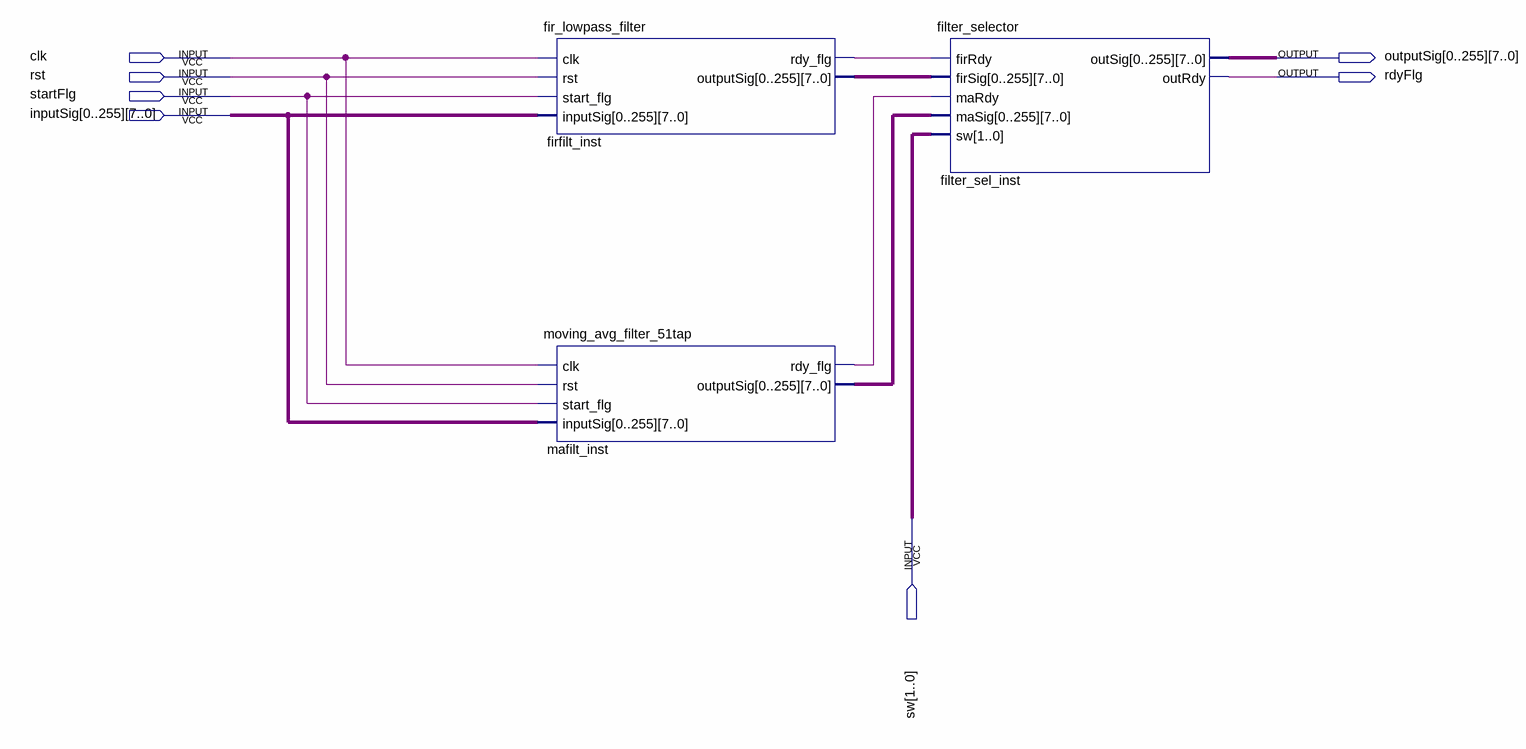
[diagram p0: schematic sheet]
// Quartus schematic Filters.bdf as structural Verilog: 3 symbols, 7 pins
module Filters (
  input  clk,
  input  rst,
  input  startFlg,
  input  [7:0] inputSig_0,
  input  [7:0] inputSig_1,
  input  [7:0] inputSig_2,
  input  [7:0] inputSig_3,
  input  [7:0] inputSig_4,
  input  [7:0] inputSig_5,
  input  [7:0] inputSig_6,
  input  [7:0] inputSig_7,
  input  [7:0] inputSig_8,
  input  [7:0] inputSig_9,
  input  [7:0] inputSig_10,
  input  [7:0] inputSig_11,
  input  [7:0] inputSig_12,
  input  [7:0] inputSig_13,
  input  [7:0] inputSig_14,
  input  [7:0] inputSig_15,
  input  [7:0] inputSig_16,
  input  [7:0] inputSig_17,
  input  [7:0] inputSig_18,
  input  [7:0] inputSig_19,
  input  [7:0] inputSig_20,
  input  [7:0] inputSig_21,
  input  [7:0] inputSig_22,
  input  [7:0] inputSig_23,
  input  [7:0] inputSig_24,
  input  [7:0] inputSig_25,
  input  [7:0] inputSig_26,
  input  [7:0] inputSig_27,
  input  [7:0] inputSig_28,
  input  [7:0] inputSig_29,
  input  [7:0] inputSig_30,
  input  [7:0] inputSig_31,
  input  [7:0] inputSig_32,
  input  [7:0] inputSig_33,
  input  [7:0] inputSig_34,
  input  [7:0] inputSig_35,
  input  [7:0] inputSig_36,
  input  [7:0] inputSig_37,
  input  [7:0] inputSig_38,
  input  [7:0] inputSig_39,
  input  [7:0] inputSig_40,
  input  [7:0] inputSig_41,
  input  [7:0] inputSig_42,
  input  [7:0] inputSig_43,
  input  [7:0] inputSig_44,
  input  [7:0] inputSig_45,
  input  [7:0] inputSig_46,
  input  [7:0] inputSig_47,
  input  [7:0] inputSig_48,
  input  [7:0] inputSig_49,
  input  [7:0] inputSig_50,
  input  [7:0] inputSig_51,
  input  [7:0] inputSig_52,
  input  [7:0] inputSig_53,
  input  [7:0] inputSig_54,
  input  [7:0] inputSig_55,
  input  [7:0] inputSig_56,
  input  [7:0] inputSig_57,
  input  [7:0] inputSig_58,
  input  [7:0] inputSig_59,
  input  [7:0] inputSig_60,
  input  [7:0] inputSig_61,
  input  [7:0] inputSig_62,
  input  [7:0] inputSig_63,
  input  [7:0] inputSig_64,
  input  [7:0] inputSig_65,
  input  [7:0] inputSig_66,
  input  [7:0] inputSig_67,
  input  [7:0] inputSig_68,
  input  [7:0] inputSig_69,
  input  [7:0] inputSig_70,
  input  [7:0] inputSig_71,
  input  [7:0] inputSig_72,
  input  [7:0] inputSig_73,
  input  [7:0] inputSig_74,
  input  [7:0] inputSig_75,
  input  [7:0] inputSig_76,
  input  [7:0] inputSig_77,
  input  [7:0] inputSig_78,
  input  [7:0] inputSig_79,
  input  [7:0] inputSig_80,
  input  [7:0] inputSig_81,
  input  [7:0] inputSig_82,
  input  [7:0] inputSig_83,
  input  [7:0] inputSig_84,
  input  [7:0] inputSig_85,
  input  [7:0] inputSig_86,
  input  [7:0] inputSig_87,
  input  [7:0] inputSig_88,
  input  [7:0] inputSig_89,
  input  [7:0] inputSig_90,
  input  [7:0] inputSig_91,
  input  [7:0] inputSig_92,
  input  [7:0] inputSig_93,
  input  [7:0] inputSig_94,
  input  [7:0] inputSig_95,
  input  [7:0] inputSig_96,
  input  [7:0] inputSig_97,
  input  [7:0] inputSig_98,
  input  [7:0] inputSig_99,
  input  [7:0] inputSig_100,
  input  [7:0] inputSig_101,
  input  [7:0] inputSig_102,
  input  [7:0] inputSig_103,
  input  [7:0] inputSig_104,
  input  [7:0] inputSig_105,
  input  [7:0] inputSig_106,
  input  [7:0] inputSig_107,
  input  [7:0] inputSig_108,
  input  [7:0] inputSig_109,
  input  [7:0] inputSig_110,
  input  [7:0] inputSig_111,
  input  [7:0] inputSig_112,
  input  [7:0] inputSig_113,
  input  [7:0] inputSig_114,
  input  [7:0] inputSig_115,
  input  [7:0] inputSig_116,
  input  [7:0] inputSig_117,
  input  [7:0] inputSig_118,
  input  [7:0] inputSig_119,
  input  [7:0] inputSig_120,
  input  [7:0] inputSig_121,
  input  [7:0] inputSig_122,
  input  [7:0] inputSig_123,
  input  [7:0] inputSig_124,
  input  [7:0] inputSig_125,
  input  [7:0] inputSig_126,
  input  [7:0] inputSig_127,
  input  [7:0] inputSig_128,
  input  [7:0] inputSig_129,
  input  [7:0] inputSig_130,
  input  [7:0] inputSig_131,
  input  [7:0] inputSig_132,
  input  [7:0] inputSig_133,
  input  [7:0] inputSig_134,
  input  [7:0] inputSig_135,
  input  [7:0] inputSig_136,
  input  [7:0] inputSig_137,
  input  [7:0] inputSig_138,
  input  [7:0] inputSig_139,
  input  [7:0] inputSig_140,
  input  [7:0] inputSig_141,
  input  [7:0] inputSig_142,
  input  [7:0] inputSig_143,
  input  [7:0] inputSig_144,
  input  [7:0] inputSig_145,
  input  [7:0] inputSig_146,
  input  [7:0] inputSig_147,
  input  [7:0] inputSig_148,
  input  [7:0] inputSig_149,
  input  [7:0] inputSig_150,
  input  [7:0] inputSig_151,
  input  [7:0] inputSig_152,
  input  [7:0] inputSig_153,
  input  [7:0] inputSig_154,
  input  [7:0] inputSig_155,
  input  [7:0] inputSig_156,
  input  [7:0] inputSig_157,
  input  [7:0] inputSig_158,
  input  [7:0] inputSig_159,
  input  [7:0] inputSig_160,
  input  [7:0] inputSig_161,
  input  [7:0] inputSig_162,
  input  [7:0] inputSig_163,
  input  [7:0] inputSig_164,
  input  [7:0] inputSig_165,
  input  [7:0] inputSig_166,
  input  [7:0] inputSig_167,
  input  [7:0] inputSig_168,
  input  [7:0] inputSig_169,
  input  [7:0] inputSig_170,
  input  [7:0] inputSig_171,
  input  [7:0] inputSig_172,
  input  [7:0] inputSig_173,
  input  [7:0] inputSig_174,
  input  [7:0] inputSig_175,
  input  [7:0] inputSig_176,
  input  [7:0] inputSig_177,
  input  [7:0] inputSig_178,
  input  [7:0] inputSig_179,
  input  [7:0] inputSig_180,
  input  [7:0] inputSig_181,
  input  [7:0] inputSig_182,
  input  [7:0] inputSig_183,
  input  [7:0] inputSig_184,
  input  [7:0] inputSig_185,
  input  [7:0] inputSig_186,
  input  [7:0] inputSig_187,
  input  [7:0] inputSig_188,
  input  [7:0] inputSig_189,
  input  [7:0] inputSig_190,
  input  [7:0] inputSig_191,
  input  [7:0] inputSig_192,
  input  [7:0] inputSig_193,
  input  [7:0] inputSig_194,
  input  [7:0] inputSig_195,
  input  [7:0] inputSig_196,
  input  [7:0] inputSig_197,
  input  [7:0] inputSig_198,
  input  [7:0] inputSig_199,
  input  [7:0] inputSig_200,
  input  [7:0] inputSig_201,
  input  [7:0] inputSig_202,
  input  [7:0] inputSig_203,
  input  [7:0] inputSig_204,
  input  [7:0] inputSig_205,
  input  [7:0] inputSig_206,
  input  [7:0] inputSig_207,
  input  [7:0] inputSig_208,
  input  [7:0] inputSig_209,
  input  [7:0] inputSig_210,
  input  [7:0] inputSig_211,
  input  [7:0] inputSig_212,
  input  [7:0] inputSig_213,
  input  [7:0] inputSig_214,
  input  [7:0] inputSig_215,
  input  [7:0] inputSig_216,
  input  [7:0] inputSig_217,
  input  [7:0] inputSig_218,
  input  [7:0] inputSig_219,
  input  [7:0] inputSig_220,
  input  [7:0] inputSig_221,
  input  [7:0] inputSig_222,
  input  [7:0] inputSig_223,
  input  [7:0] inputSig_224,
  input  [7:0] inputSig_225,
  input  [7:0] inputSig_226,
  input  [7:0] inputSig_227,
  input  [7:0] inputSig_228,
  input  [7:0] inputSig_229,
  input  [7:0] inputSig_230,
  input  [7:0] inputSig_231,
  input  [7:0] inputSig_232,
  input  [7:0] inputSig_233,
  input  [7:0] inputSig_234,
  input  [7:0] inputSig_235,
  input  [7:0] inputSig_236,
  input  [7:0] inputSig_237,
  input  [7:0] inputSig_238,
  input  [7:0] inputSig_239,
  input  [7:0] inputSig_240,
  input  [7:0] inputSig_241,
  input  [7:0] inputSig_242,
  input  [7:0] inputSig_243,
  input  [7:0] inputSig_244,
  input  [7:0] inputSig_245,
  input  [7:0] inputSig_246,
  input  [7:0] inputSig_247,
  input  [7:0] inputSig_248,
  input  [7:0] inputSig_249,
  input  [7:0] inputSig_250,
  input  [7:0] inputSig_251,
  input  [7:0] inputSig_252,
  input  [7:0] inputSig_253,
  input  [7:0] inputSig_254,
  input  [7:0] inputSig_255,
  input  [1:0] sw,
  output [7:0] outputSig_0,
  output [7:0] outputSig_1,
  output [7:0] outputSig_2,
  output [7:0] outputSig_3,
  output [7:0] outputSig_4,
  output [7:0] outputSig_5,
  output [7:0] outputSig_6,
  output [7:0] outputSig_7,
  output [7:0] outputSig_8,
  output [7:0] outputSig_9,
  output [7:0] outputSig_10,
  output [7:0] outputSig_11,
  output [7:0] outputSig_12,
  output [7:0] outputSig_13,
  output [7:0] outputSig_14,
  output [7:0] outputSig_15,
  output [7:0] outputSig_16,
  output [7:0] outputSig_17,
  output [7:0] outputSig_18,
  output [7:0] outputSig_19,
  output [7:0] outputSig_20,
  output [7:0] outputSig_21,
  output [7:0] outputSig_22,
  output [7:0] outputSig_23,
  output [7:0] outputSig_24,
  output [7:0] outputSig_25,
  output [7:0] outputSig_26,
  output [7:0] outputSig_27,
  output [7:0] outputSig_28,
  output [7:0] outputSig_29,
  output [7:0] outputSig_30,
  output [7:0] outputSig_31,
  output [7:0] outputSig_32,
  output [7:0] outputSig_33,
  output [7:0] outputSig_34,
  output [7:0] outputSig_35,
  output [7:0] outputSig_36,
  output [7:0] outputSig_37,
  output [7:0] outputSig_38,
  output [7:0] outputSig_39,
  output [7:0] outputSig_40,
  output [7:0] outputSig_41,
  output [7:0] outputSig_42,
  output [7:0] outputSig_43,
  output [7:0] outputSig_44,
  output [7:0] outputSig_45,
  output [7:0] outputSig_46,
  output [7:0] outputSig_47,
  output [7:0] outputSig_48,
  output [7:0] outputSig_49,
  output [7:0] outputSig_50,
  output [7:0] outputSig_51,
  output [7:0] outputSig_52,
  output [7:0] outputSig_53,
  output [7:0] outputSig_54,
  output [7:0] outputSig_55,
  output [7:0] outputSig_56,
  output [7:0] outputSig_57,
  output [7:0] outputSig_58,
  output [7:0] outputSig_59,
  output [7:0] outputSig_60,
  output [7:0] outputSig_61,
  output [7:0] outputSig_62,
  output [7:0] outputSig_63,
  output [7:0] outputSig_64,
  output [7:0] outputSig_65,
  output [7:0] outputSig_66,
  output [7:0] outputSig_67,
  output [7:0] outputSig_68,
  output [7:0] outputSig_69,
  output [7:0] outputSig_70,
  output [7:0] outputSig_71,
  output [7:0] outputSig_72,
  output [7:0] outputSig_73,
  output [7:0] outputSig_74,
  output [7:0] outputSig_75,
  output [7:0] outputSig_76,
  output [7:0] outputSig_77,
  output [7:0] outputSig_78,
  output [7:0] outputSig_79,
  output [7:0] outputSig_80,
  output [7:0] outputSig_81,
  output [7:0] outputSig_82,
  output [7:0] outputSig_83,
  output [7:0] outputSig_84,
  output [7:0] outputSig_85,
  output [7:0] outputSig_86,
  output [7:0] outputSig_87,
  output [7:0] outputSig_88,
  output [7:0] outputSig_89,
  output [7:0] outputSig_90,
  output [7:0] outputSig_91,
  output [7:0] outputSig_92,
  output [7:0] outputSig_93,
  output [7:0] outputSig_94,
  output [7:0] outputSig_95,
  output [7:0] outputSig_96,
  output [7:0] outputSig_97,
  output [7:0] outputSig_98,
  output [7:0] outputSig_99,
  output [7:0] outputSig_100,
  output [7:0] outputSig_101,
  output [7:0] outputSig_102,
  output [7:0] outputSig_103,
  output [7:0] outputSig_104,
  output [7:0] outputSig_105,
  output [7:0] outputSig_106,
  output [7:0] outputSig_107,
  output [7:0] outputSig_108,
  output [7:0] outputSig_109,
  output [7:0] outputSig_110,
  output [7:0] outputSig_111,
  output [7:0] outputSig_112,
  output [7:0] outputSig_113,
  output [7:0] outputSig_114,
  output [7:0] outputSig_115,
  output [7:0] outputSig_116,
  output [7:0] outputSig_117,
  output [7:0] outputSig_118,
  output [7:0] outputSig_119,
  output [7:0] outputSig_120,
  output [7:0] outputSig_121,
  output [7:0] outputSig_122,
  output [7:0] outputSig_123,
  output [7:0] outputSig_124,
  output [7:0] outputSig_125,
  output [7:0] outputSig_126,
  output [7:0] outputSig_127,
  output [7:0] outputSig_128,
  output [7:0] outputSig_129,
  output [7:0] outputSig_130,
  output [7:0] outputSig_131,
  output [7:0] outputSig_132,
  output [7:0] outputSig_133,
  output [7:0] outputSig_134,
  output [7:0] outputSig_135,
  output [7:0] outputSig_136,
  output [7:0] outputSig_137,
  output [7:0] outputSig_138,
  output [7:0] outputSig_139,
  output [7:0] outputSig_140,
  output [7:0] outputSig_141,
  output [7:0] outputSig_142,
  output [7:0] outputSig_143,
  output [7:0] outputSig_144,
  output [7:0] outputSig_145,
  output [7:0] outputSig_146,
  output [7:0] outputSig_147,
  output [7:0] outputSig_148,
  output [7:0] outputSig_149,
  output [7:0] outputSig_150,
  output [7:0] outputSig_151,
  output [7:0] outputSig_152,
  output [7:0] outputSig_153,
  output [7:0] outputSig_154,
  output [7:0] outputSig_155,
  output [7:0] outputSig_156,
  output [7:0] outputSig_157,
  output [7:0] outputSig_158,
  output [7:0] outputSig_159,
  output [7:0] outputSig_160,
  output [7:0] outputSig_161,
  output [7:0] outputSig_162,
  output [7:0] outputSig_163,
  output [7:0] outputSig_164,
  output [7:0] outputSig_165,
  output [7:0] outputSig_166,
  output [7:0] outputSig_167,
  output [7:0] outputSig_168,
  output [7:0] outputSig_169,
  output [7:0] outputSig_170,
  output [7:0] outputSig_171,
  output [7:0] outputSig_172,
  output [7:0] outputSig_173,
  output [7:0] outputSig_174,
  output [7:0] outputSig_175,
  output [7:0] outputSig_176,
  output [7:0] outputSig_177,
  output [7:0] outputSig_178,
  output [7:0] outputSig_179,
  output [7:0] outputSig_180,
  output [7:0] outputSig_181,
  output [7:0] outputSig_182,
  output [7:0] outputSig_183,
  output [7:0] outputSig_184,
  output [7:0] outputSig_185,
  output [7:0] outputSig_186,
  output [7:0] outputSig_187,
  output [7:0] outputSig_188,
  output [7:0] outputSig_189,
  output [7:0] outputSig_190,
  output [7:0] outputSig_191,
  output [7:0] outputSig_192,
  output [7:0] outputSig_193,
  output [7:0] outputSig_194,
  output [7:0] outputSig_195,
  output [7:0] outputSig_196,
  output [7:0] outputSig_197,
  output [7:0] outputSig_198,
  output [7:0] outputSig_199,
  output [7:0] outputSig_200,
  output [7:0] outputSig_201,
  output [7:0] outputSig_202,
  output [7:0] outputSig_203,
  output [7:0] outputSig_204,
  output [7:0] outputSig_205,
  output [7:0] outputSig_206,
  output [7:0] outputSig_207,
  output [7:0] outputSig_208,
  output [7:0] outputSig_209,
  output [7:0] outputSig_210,
  output [7:0] outputSig_211,
  output [7:0] outputSig_212,
  output [7:0] outputSig_213,
  output [7:0] outputSig_214,
  output [7:0] outputSig_215,
  output [7:0] outputSig_216,
  output [7:0] outputSig_217,
  output [7:0] outputSig_218,
  output [7:0] outputSig_219,
  output [7:0] outputSig_220,
  output [7:0] outputSig_221,
  output [7:0] outputSig_222,
  output [7:0] outputSig_223,
  output [7:0] outputSig_224,
  output [7:0] outputSig_225,
  output [7:0] outputSig_226,
  output [7:0] outputSig_227,
  output [7:0] outputSig_228,
  output [7:0] outputSig_229,
  output [7:0] outputSig_230,
  output [7:0] outputSig_231,
  output [7:0] outputSig_232,
  output [7:0] outputSig_233,
  output [7:0] outputSig_234,
  output [7:0] outputSig_235,
  output [7:0] outputSig_236,
  output [7:0] outputSig_237,
  output [7:0] outputSig_238,
  output [7:0] outputSig_239,
  output [7:0] outputSig_240,
  output [7:0] outputSig_241,
  output [7:0] outputSig_242,
  output [7:0] outputSig_243,
  output [7:0] outputSig_244,
  output [7:0] outputSig_245,
  output [7:0] outputSig_246,
  output [7:0] outputSig_247,
  output [7:0] outputSig_248,
  output [7:0] outputSig_249,
  output [7:0] outputSig_250,
  output [7:0] outputSig_251,
  output [7:0] outputSig_252,
  output [7:0] outputSig_253,
  output [7:0] outputSig_254,
  output [7:0] outputSig_255,
  output rdyFlg
);

  wire firfilt_inst_rdy_flg, mafilt_inst_rdy_flg;
  wire [2047:0] firfilt_inst_outputsig, mafilt_inst_outputsig;

  fir_lowpass_filter firfilt_inst (
    .clk(clk), .rst(rst), .start_flg(startFlg),
    .inputSig({inputSig_0, inputSig_1, inputSig_2, inputSig_3, inputSig_4, inputSig_5, inputSig_6, inputSig_7, inputSig_8, inputSig_9, inputSig_10, inputSig_11, inputSig_12, inputSig_13, inputSig_14, inputSig_15, inputSig_16, inputSig_17, inputSig_18, inputSig_19, inputSig_20, inputSig_21, inputSig_22, inputSig_23, inputSig_24, inputSig_25, inputSig_26, inputSig_27, inputSig_28, inputSig_29, inputSig_30, inputSig_31, inputSig_32, inputSig_33, inputSig_34, inputSig_35, inputSig_36, inputSig_37, inputSig_38, inputSig_39, inputSig_40, inputSig_41, inputSig_42, inputSig_43, inputSig_44, inputSig_45, inputSig_46, inputSig_47, inputSig_48, inputSig_49, inputSig_50, inputSig_51, inputSig_52, inputSig_53, inputSig_54, inputSig_55, inputSig_56, inputSig_57, inputSig_58, inputSig_59, inputSig_60, inputSig_61, inputSig_62, inputSig_63, inputSig_64, inputSig_65, inputSig_66, inputSig_67, inputSig_68, inputSig_69, inputSig_70, inputSig_71, inputSig_72, inputSig_73, inputSig_74, inputSig_75, inputSig_76, inputSig_77, inputSig_78, inputSig_79, inputSig_80, inputSig_81, inputSig_82, inputSig_83, inputSig_84, inputSig_85, inputSig_86, inputSig_87, inputSig_88, inputSig_89, inputSig_90, inputSig_91, inputSig_92, inputSig_93, inputSig_94, inputSig_95, inputSig_96, inputSig_97, inputSig_98, inputSig_99, inputSig_100, inputSig_101, inputSig_102, inputSig_103, inputSig_104, inputSig_105, inputSig_106, inputSig_107, inputSig_108, inputSig_109, inputSig_110, inputSig_111, inputSig_112, inputSig_113, inputSig_114, inputSig_115, inputSig_116, inputSig_117, inputSig_118, inputSig_119, inputSig_120, inputSig_121, inputSig_122, inputSig_123, inputSig_124, inputSig_125, inputSig_126, inputSig_127, inputSig_128, inputSig_129, inputSig_130, inputSig_131, inputSig_132, inputSig_133, inputSig_134, inputSig_135, inputSig_136, inputSig_137, inputSig_138, inputSig_139, inputSig_140, inputSig_141, inputSig_142, inputSig_143, inputSig_144, inputSig_145, inputSig_146, inputSig_147, inputSig_148, inputSig_149, inputSig_150, inputSig_151, inputSig_152, inputSig_153, inputSig_154, inputSig_155, inputSig_156, inputSig_157, inputSig_158, inputSig_159, inputSig_160, inputSig_161, inputSig_162, inputSig_163, inputSig_164, inputSig_165, inputSig_166, inputSig_167, inputSig_168, inputSig_169, inputSig_170, inputSig_171, inputSig_172, inputSig_173, inputSig_174, inputSig_175, inputSig_176, inputSig_177, inputSig_178, inputSig_179, inputSig_180, inputSig_181, inputSig_182, inputSig_183, inputSig_184, inputSig_185, inputSig_186, inputSig_187, inputSig_188, inputSig_189, inputSig_190, inputSig_191, inputSig_192, inputSig_193, inputSig_194, inputSig_195, inputSig_196, inputSig_197, inputSig_198, inputSig_199, inputSig_200, inputSig_201, inputSig_202, inputSig_203, inputSig_204, inputSig_205, inputSig_206, inputSig_207, inputSig_208, inputSig_209, inputSig_210, inputSig_211, inputSig_212, inputSig_213, inputSig_214, inputSig_215, inputSig_216, inputSig_217, inputSig_218, inputSig_219, inputSig_220, inputSig_221, inputSig_222, inputSig_223, inputSig_224, inputSig_225, inputSig_226, inputSig_227, inputSig_228, inputSig_229, inputSig_230, inputSig_231, inputSig_232, inputSig_233, inputSig_234, inputSig_235, inputSig_236, inputSig_237, inputSig_238, inputSig_239, inputSig_240, inputSig_241, inputSig_242, inputSig_243, inputSig_244, inputSig_245, inputSig_246, inputSig_247, inputSig_248, inputSig_249, inputSig_250, inputSig_251, inputSig_252, inputSig_253, inputSig_254, inputSig_255}),
    .rdy_flg(firfilt_inst_rdy_flg), .outputSig(firfilt_inst_outputsig));
  moving_avg_filter_51tap mafilt_inst (
    .clk(clk), .rst(rst), .start_flg(startFlg),
    .inputSig({inputSig_0, inputSig_1, inputSig_2, inputSig_3, inputSig_4, inputSig_5, inputSig_6, inputSig_7, inputSig_8, inputSig_9, inputSig_10, inputSig_11, inputSig_12, inputSig_13, inputSig_14, inputSig_15, inputSig_16, inputSig_17, inputSig_18, inputSig_19, inputSig_20, inputSig_21, inputSig_22, inputSig_23, inputSig_24, inputSig_25, inputSig_26, inputSig_27, inputSig_28, inputSig_29, inputSig_30, inputSig_31, inputSig_32, inputSig_33, inputSig_34, inputSig_35, inputSig_36, inputSig_37, inputSig_38, inputSig_39, inputSig_40, inputSig_41, inputSig_42, inputSig_43, inputSig_44, inputSig_45, inputSig_46, inputSig_47, inputSig_48, inputSig_49, inputSig_50, inputSig_51, inputSig_52, inputSig_53, inputSig_54, inputSig_55, inputSig_56, inputSig_57, inputSig_58, inputSig_59, inputSig_60, inputSig_61, inputSig_62, inputSig_63, inputSig_64, inputSig_65, inputSig_66, inputSig_67, inputSig_68, inputSig_69, inputSig_70, inputSig_71, inputSig_72, inputSig_73, inputSig_74, inputSig_75, inputSig_76, inputSig_77, inputSig_78, inputSig_79, inputSig_80, inputSig_81, inputSig_82, inputSig_83, inputSig_84, inputSig_85, inputSig_86, inputSig_87, inputSig_88, inputSig_89, inputSig_90, inputSig_91, inputSig_92, inputSig_93, inputSig_94, inputSig_95, inputSig_96, inputSig_97, inputSig_98, inputSig_99, inputSig_100, inputSig_101, inputSig_102, inputSig_103, inputSig_104, inputSig_105, inputSig_106, inputSig_107, inputSig_108, inputSig_109, inputSig_110, inputSig_111, inputSig_112, inputSig_113, inputSig_114, inputSig_115, inputSig_116, inputSig_117, inputSig_118, inputSig_119, inputSig_120, inputSig_121, inputSig_122, inputSig_123, inputSig_124, inputSig_125, inputSig_126, inputSig_127, inputSig_128, inputSig_129, inputSig_130, inputSig_131, inputSig_132, inputSig_133, inputSig_134, inputSig_135, inputSig_136, inputSig_137, inputSig_138, inputSig_139, inputSig_140, inputSig_141, inputSig_142, inputSig_143, inputSig_144, inputSig_145, inputSig_146, inputSig_147, inputSig_148, inputSig_149, inputSig_150, inputSig_151, inputSig_152, inputSig_153, inputSig_154, inputSig_155, inputSig_156, inputSig_157, inputSig_158, inputSig_159, inputSig_160, inputSig_161, inputSig_162, inputSig_163, inputSig_164, inputSig_165, inputSig_166, inputSig_167, inputSig_168, inputSig_169, inputSig_170, inputSig_171, inputSig_172, inputSig_173, inputSig_174, inputSig_175, inputSig_176, inputSig_177, inputSig_178, inputSig_179, inputSig_180, inputSig_181, inputSig_182, inputSig_183, inputSig_184, inputSig_185, inputSig_186, inputSig_187, inputSig_188, inputSig_189, inputSig_190, inputSig_191, inputSig_192, inputSig_193, inputSig_194, inputSig_195, inputSig_196, inputSig_197, inputSig_198, inputSig_199, inputSig_200, inputSig_201, inputSig_202, inputSig_203, inputSig_204, inputSig_205, inputSig_206, inputSig_207, inputSig_208, inputSig_209, inputSig_210, inputSig_211, inputSig_212, inputSig_213, inputSig_214, inputSig_215, inputSig_216, inputSig_217, inputSig_218, inputSig_219, inputSig_220, inputSig_221, inputSig_222, inputSig_223, inputSig_224, inputSig_225, inputSig_226, inputSig_227, inputSig_228, inputSig_229, inputSig_230, inputSig_231, inputSig_232, inputSig_233, inputSig_234, inputSig_235, inputSig_236, inputSig_237, inputSig_238, inputSig_239, inputSig_240, inputSig_241, inputSig_242, inputSig_243, inputSig_244, inputSig_245, inputSig_246, inputSig_247, inputSig_248, inputSig_249, inputSig_250, inputSig_251, inputSig_252, inputSig_253, inputSig_254, inputSig_255}),
    .rdy_flg(mafilt_inst_rdy_flg), .outputSig(mafilt_inst_outputsig));
  filter_selector filter_sel_inst (
    .firSig(firfilt_inst_outputsig), .maSig(mafilt_inst_outputsig), .firRdy(firfilt_inst_rdy_flg),
    .maRdy(mafilt_inst_rdy_flg), .sw(sw),
    .outSig({outputSig_0, outputSig_1, outputSig_2, outputSig_3, outputSig_4, outputSig_5, outputSig_6, outputSig_7, outputSig_8, outputSig_9, outputSig_10, outputSig_11, outputSig_12, outputSig_13, outputSig_14, outputSig_15, outputSig_16, outputSig_17, outputSig_18, outputSig_19, outputSig_20, outputSig_21, outputSig_22, outputSig_23, outputSig_24, outputSig_25, outputSig_26, outputSig_27, outputSig_28, outputSig_29, outputSig_30, outputSig_31, outputSig_32, outputSig_33, outputSig_34, outputSig_35, outputSig_36, outputSig_37, outputSig_38, outputSig_39, outputSig_40, outputSig_41, outputSig_42, outputSig_43, outputSig_44, outputSig_45, outputSig_46, outputSig_47, outputSig_48, outputSig_49, outputSig_50, outputSig_51, outputSig_52, outputSig_53, outputSig_54, outputSig_55, outputSig_56, outputSig_57, outputSig_58, outputSig_59, outputSig_60, outputSig_61, outputSig_62, outputSig_63, outputSig_64, outputSig_65, outputSig_66, outputSig_67, outputSig_68, outputSig_69, outputSig_70, outputSig_71, outputSig_72, outputSig_73, outputSig_74, outputSig_75, outputSig_76, outputSig_77, outputSig_78, outputSig_79, outputSig_80, outputSig_81, outputSig_82, outputSig_83, outputSig_84, outputSig_85, outputSig_86, outputSig_87, outputSig_88, outputSig_89, outputSig_90, outputSig_91, outputSig_92, outputSig_93, outputSig_94, outputSig_95, outputSig_96, outputSig_97, outputSig_98, outputSig_99, outputSig_100, outputSig_101, outputSig_102, outputSig_103, outputSig_104, outputSig_105, outputSig_106, outputSig_107, outputSig_108, outputSig_109, outputSig_110, outputSig_111, outputSig_112, outputSig_113, outputSig_114, outputSig_115, outputSig_116, outputSig_117, outputSig_118, outputSig_119, outputSig_120, outputSig_121, outputSig_122, outputSig_123, outputSig_124, outputSig_125, outputSig_126, outputSig_127, outputSig_128, outputSig_129, outputSig_130, outputSig_131, outputSig_132, outputSig_133, outputSig_134, outputSig_135, outputSig_136, outputSig_137, outputSig_138, outputSig_139, outputSig_140, outputSig_141, outputSig_142, outputSig_143, outputSig_144, outputSig_145, outputSig_146, outputSig_147, outputSig_148, outputSig_149, outputSig_150, outputSig_151, outputSig_152, outputSig_153, outputSig_154, outputSig_155, outputSig_156, outputSig_157, outputSig_158, outputSig_159, outputSig_160, outputSig_161, outputSig_162, outputSig_163, outputSig_164, outputSig_165, outputSig_166, outputSig_167, outputSig_168, outputSig_169, outputSig_170, outputSig_171, outputSig_172, outputSig_173, outputSig_174, outputSig_175, outputSig_176, outputSig_177, outputSig_178, outputSig_179, outputSig_180, outputSig_181, outputSig_182, outputSig_183, outputSig_184, outputSig_185, outputSig_186, outputSig_187, outputSig_188, outputSig_189, outputSig_190, outputSig_191, outputSig_192, outputSig_193, outputSig_194, outputSig_195, outputSig_196, outputSig_197, outputSig_198, outputSig_199, outputSig_200, outputSig_201, outputSig_202, outputSig_203, outputSig_204, outputSig_205, outputSig_206, outputSig_207, outputSig_208, outputSig_209, outputSig_210, outputSig_211, outputSig_212, outputSig_213, outputSig_214, outputSig_215, outputSig_216, outputSig_217, outputSig_218, outputSig_219, outputSig_220, outputSig_221, outputSig_222, outputSig_223, outputSig_224, outputSig_225, outputSig_226, outputSig_227, outputSig_228, outputSig_229, outputSig_230, outputSig_231, outputSig_232, outputSig_233, outputSig_234, outputSig_235, outputSig_236, outputSig_237, outputSig_238, outputSig_239, outputSig_240, outputSig_241, outputSig_242, outputSig_243, outputSig_244, outputSig_245, outputSig_246, outputSig_247, outputSig_248, outputSig_249, outputSig_250, outputSig_251, outputSig_252, outputSig_253, outputSig_254, outputSig_255}),
    .outRdy(rdyFlg));
endmodule
